# EAGLE design dip_s9032-02 (EAGLE 9.2.2)
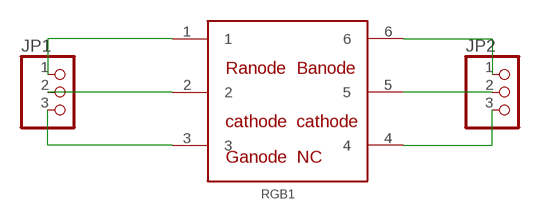
[diagram p0: schematic, sheet 1]

## Parts
JP1  PINHD-1X3  [1X03]
JP2  PINHD-1X3  [1X03]
RGB1  S9032-02  [RGB_SENSOR]

## Nets
N$1: JP1.1 RGB1.1
N$2: JP1.2 RGB1.2
N$3: JP1.3 RGB1.3
N$4: JP2.1 RGB1.6
N$5: JP2.2 RGB1.5
N$6: JP2.3 RGB1.4

## Library data of the parts
JP1 JP2 = pinhead:PINHD-1X3: PIN HEADER
RGB1 = rgb_sensor:S9032-02

## Board
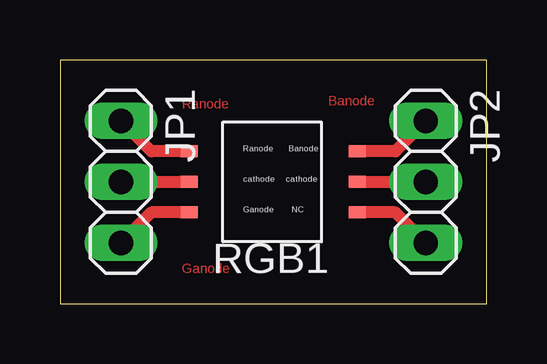
[diagram p1: board, top side]

Size 17.78 x 10.16 mm. Coordinates in mm from the lower left corner, seen from the top.
Outline: 0,0 17.78,0 17.78,10.16 0,10.16 0,0
Copper layers (1*16): Top 0.035mm / dielectric 1.5mm / Bottom 0.035mm
Design rules "default": minimum track width 6mil, minimum drill 0.35mm, track to track 6mil, track to pad 6mil, pad to pad 6mil, via to via 6mil, smd to smd 6mil, copper to edge 40mil, drill to drill 6mil, minimum pad ring 10mil, minimum via ring 8mil, stop-mask expansion 4mil, vias tented up to drill 0mil, thermal gap 10mil

### Footprints (pad centres in the part's own frame; a part is rotated, then mirrored left to right if it is on the bottom)
1X03 = drill 1.016 long: 1 -2.54,0; 2 0,0; 3 2.54,0
RGB_SENSOR = smd 0.7 x 0.5: 1 -3.5,1.27; 2 -3.5,0; 3 -3.5,-1.27; 4 3.5,-1.27; 5 3.5,0; 6 3.5,1.27

### Placement (x,y rotation side)
JP1  2.54,5.08 270 top
JP2  15.24,5.08 270 top
RGB1  8.89,5.08 0 top

### Tracks (layer width: path | path; a pad name or v marks a point on that pad's centre or on a via)
N$1
  Top 0.508: RGB1.1 3.81,6.35 JP1.1
N$2
  Top 0.508: JP1.2 RGB1.2
N$3
  Top 0.508: RGB1.3 3.81,3.81 JP1.3
N$4
  Top 0.508: JP2.1 13.97,6.35 RGB1.6
N$5
  Top 0.508: RGB1.5 JP2.2
N$6
  Top 0.508: JP2.3 13.97,3.81 RGB1.4

### Text on the board
Top: Ranode | Banode | Ganode